# Altium schematic sheet tree_power.SchDoc
size A4
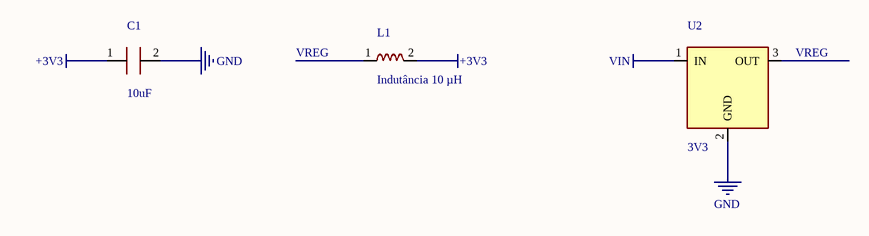
[diagram p0: tree_power.SchDoc]

## Parts
C1  10uF  [C0603]
L1  Indutância 10 µH  [L0805]
U2  3V3  [SOT223]

## Nets
+3V3: C1.1(A) L1.2(B)
GND: C1.2(B) U2.2(GND)
VIN: U2.1(IN)
VREG: L1.1(A) U2.3(OUT)

## Library data of the parts
C1 = Capacitor: MPN: X-1; Note: tolerância ±10 %
L1 = Inductor
U2 = Linear_Regulator